# Altium schematic sheet BG_IO_Schematic.SchDoc
size A; SheetNumber: 5; SheetTotal: 5
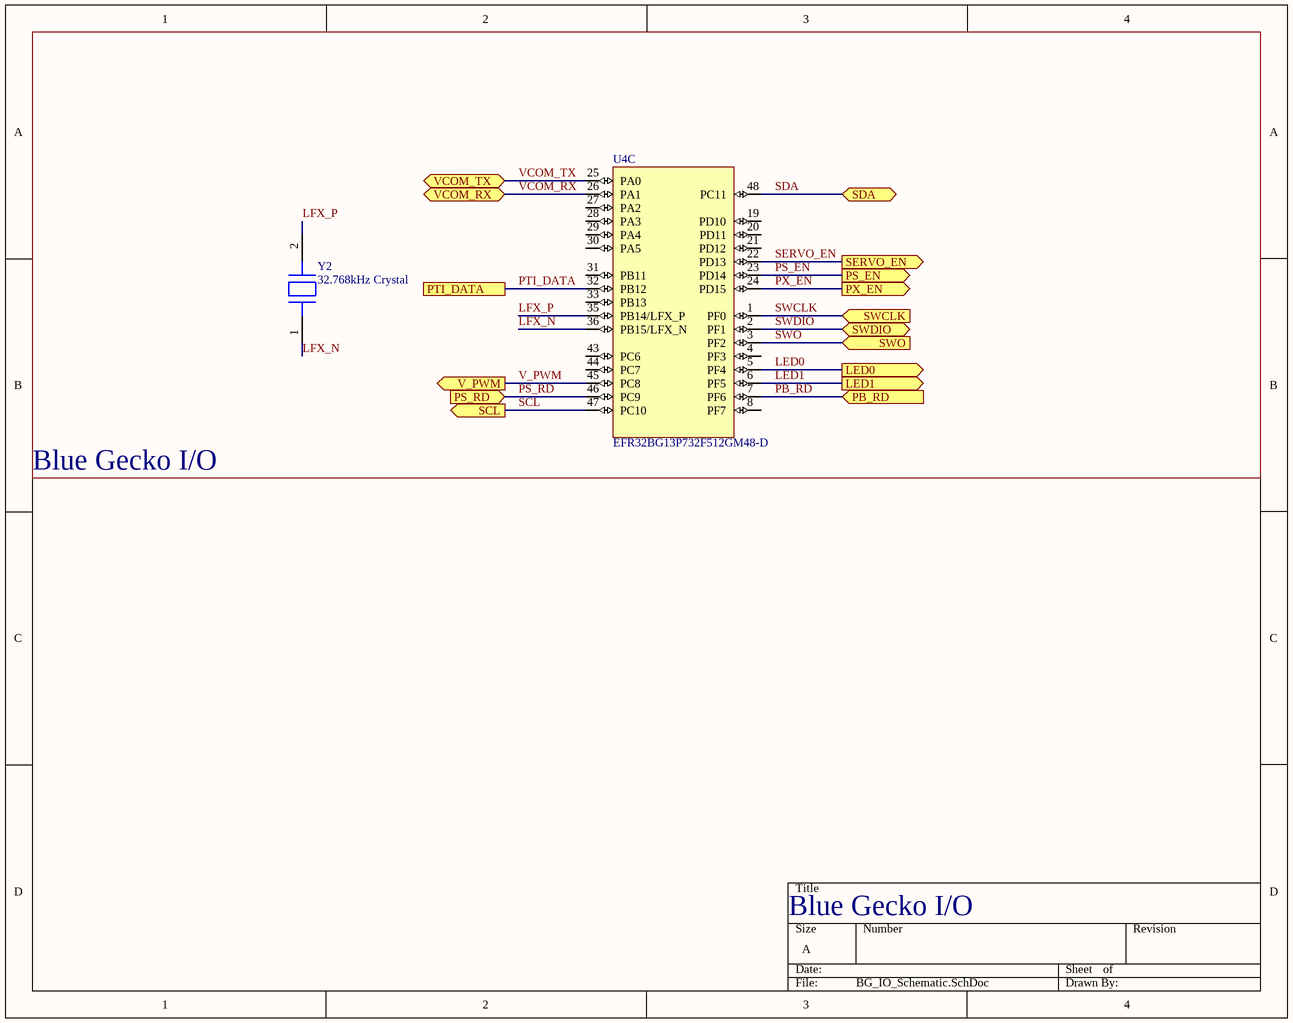
[diagram p0: BG_IO_Schematic.SchDoc]

## Parts
U4  EFR32BG13P732F512GM48-D  [48-QFN_7x7]  (part C of 3)
Y2  32.768kHz Crystal  [DFN153P160X50-2N]

## Blocks framed on the sheet
Blue Gecko I/O: U4 Y2

## Ports
LED0 (out), LED1 (out), PB_RD (in), PS_EN (out), PS_RD (in), PTI_DATA, PX_EN (out), SCL (out), SDA (bidir), SERVO_EN (out), SWCLK (in), SWDIO (bidir), SWO (in), V_PWM (out), VCOM_RX (bidir), VCOM_TX (bidir)

## Nets
LED0: U4.5(PF4) ; port LED0
LED1: U4.6(PF5) ; port LED1
LFX_N: U4.36(PB15/LFX_N) Y2.1
LFX_P: U4.35(PB14/LFX_P) Y2.2
PB_RD: U4.7(PF6) ; port PB_RD
PS_EN: U4.23(PD14) ; port PS_EN
PS_RD: U4.46(PC9) ; port PS_RD
PTI_DATA: U4.32(PB12) ; port PTI_DATA
PX_EN: U4.24(PD15) ; port PX_EN
SCL: U4.47(PC10) ; port SCL
SDA: U4.48(PC11) ; port SDA
SERVO_EN: U4.22(PD13) ; port SERVO_EN
SWCLK: U4.1(PF0) ; port SWCLK
SWDIO: U4.2(PF1) ; port SWDIO
SWO: U4.3(PF2) ; port SWO
V_PWM: U4.45(PC8) ; port V_PWM
VCOM_RX: U4.26(PA1) ; port VCOM_RX
VCOM_TX: U4.25(PA0) ; port VCOM_TX

Not connected (* = marked no-connect by the designer): U4 4(PF3) 8(PF7) 19(PD10) 20(PD11) 21(PD12) 27(PA2) 28(PA3) 29(PA4) 30(PA5) 31(PB11) 33(PB13) 43(PC6) 44(PC7)

## Notes on the sheet
- Blue Gecko I/O

## Library data of the parts
U4 = EFR32BG13P732F512GM48-D: Blue Gecko QFN48 2.4 G 19 dB BLE/Proprietary 512 kB 64 kB(RAM) 31GPIO; Manufacturer: Silicon Labs; Supplier 1: Digi-Key; RoHS: Yes; Category: RF Receivers, Transceivers; Pricing 1: 1=8.42000, 10=7.72000, 25=7.01800, 80=6.31625, 230=5.78987, 440=5.26350, 945=4.78499 (USD); ComponentLink1URL: http://www.farnell.com/datasheets/2813683.pdf?src-supplier=Farnell; ComponentLink1Description: http://www.farnell.com/datasheets/2813683.pdf?src-supplier=Farnell; Supplier Part Number 1: 336-5922-ND; Manufacturer Part Number: EFR32BG13P732F512GM48-D
Y2 = ABS05-32.768KHZ-7-T: CRYSTAL 32.768KHZ 7PF SMD; Manufacturer: Abracon; Supplier 1: Digi-Key; Manufacturer Part Number: ABS05-32.768KHZ-7-T; RoHS: No; Category: Uncategorized; Stock 1: 18000; Pricing 1: 1=1.51000, 10=1.44500, 50=1.41120, 100=1.20960, 500=1.17600, 1000=0.99120 (USD)